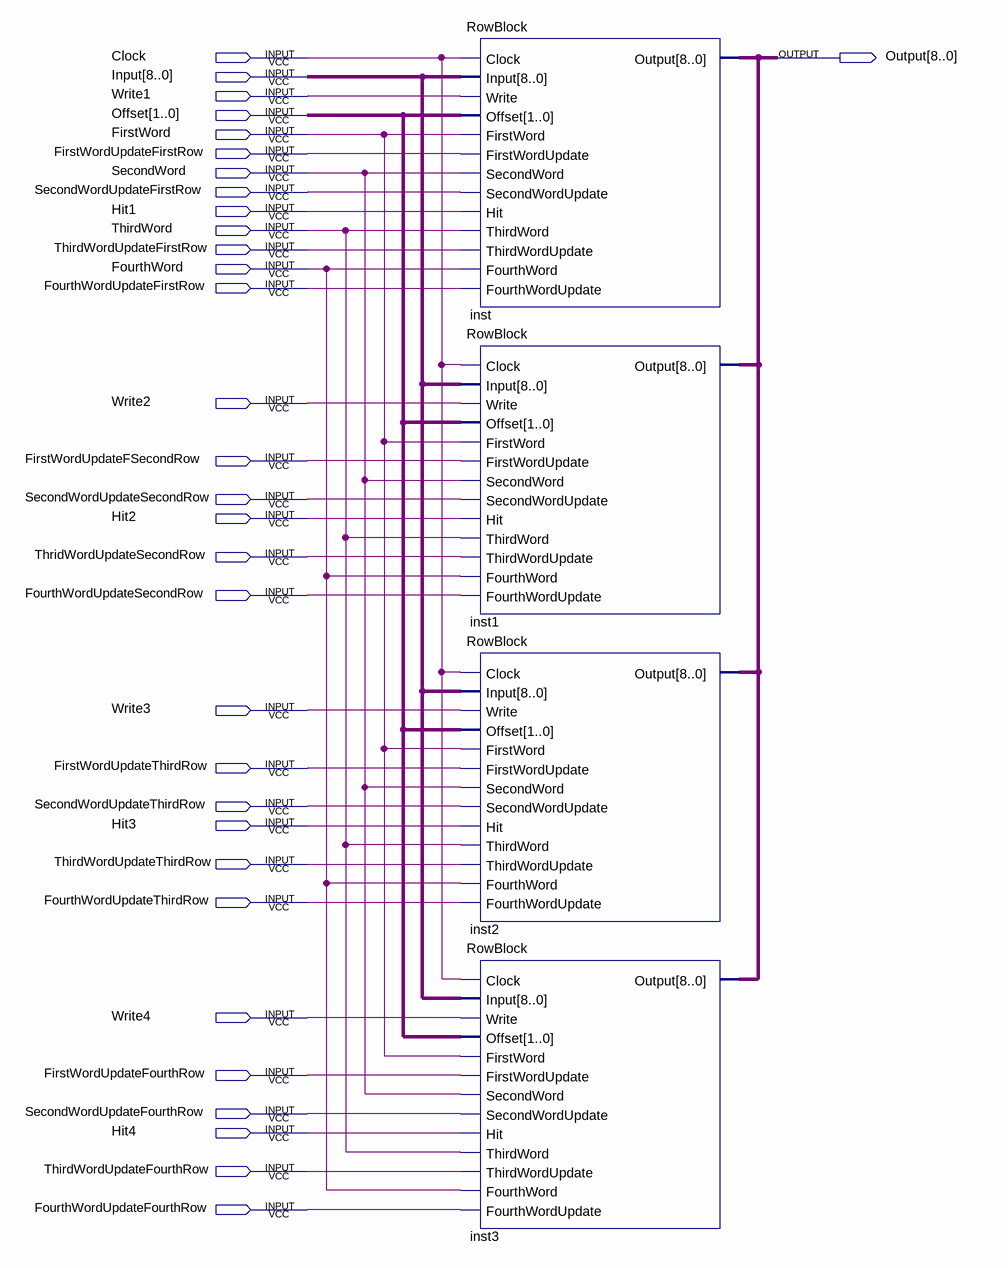
[diagram p0: schematic sheet]
// Quartus schematic BankBlock.bdf as structural Verilog: 4 symbols, 32 pins
module BankBlock (
  input  Clock,
  input  [8:0] Input,
  input  Write1,
  input  [1:0] Offset,
  input  FirstWord,
  input  FirstWordUpdateFirstRow,
  input  SecondWord,
  input  SecondWordUpdateFirstRow,
  input  Hit1,
  input  ThirdWord,
  input  ThirdWordUpdateFirstRow,
  input  FourthWord,
  input  FourthWordUpdateFirstRow,
  input  Write2,
  input  FirstWordUpdateFSecondRow,
  input  SecondWordUpdateSecondRow,
  input  Hit2,
  input  ThridWordUpdateSecondRow,
  input  FourthWordUpdateSecondRow,
  input  Write3,
  input  FirstWordUpdateThirdRow,
  input  SecondWordUpdateThirdRow,
  input  Hit3,
  input  ThirdWordUpdateThirdRow,
  input  FourthWordUpdateThirdRow,
  input  Write4,
  input  FirstWordUpdateFourthRow,
  input  SecondWordUpdateFourthRow,
  input  Hit4,
  input  ThirdWordUpdateFourthRow,
  input  FourthWordUpdateFourthRow,
  output [8:0] Output
);

  RowBlock inst (
    .Clock(Clock), .Input(Input), .Write(Write1), .Offset(Offset), .FirstWord(FirstWord),
    .FirstWordUpdate(FirstWordUpdateFirstRow), .SecondWord(SecondWord),
    .SecondWordUpdate(SecondWordUpdateFirstRow), .Hit(Hit1), .ThirdWord(ThirdWord),
    .ThirdWordUpdate(ThirdWordUpdateFirstRow), .FourthWord(FourthWord),
    .FourthWordUpdate(FourthWordUpdateFirstRow), .Output(Output));
  RowBlock inst1 (
    .Clock(Clock), .Input(Input), .Write(Write2), .Offset(Offset), .FirstWord(FirstWord),
    .FirstWordUpdate(FirstWordUpdateFSecondRow), .SecondWord(SecondWord),
    .SecondWordUpdate(SecondWordUpdateSecondRow), .Hit(Hit2), .ThirdWord(ThirdWord),
    .ThirdWordUpdate(ThridWordUpdateSecondRow), .FourthWord(FourthWord),
    .FourthWordUpdate(FourthWordUpdateSecondRow), .Output(Output));
  RowBlock inst2 (
    .Clock(Clock), .Input(Input), .Write(Write3), .Offset(Offset), .FirstWord(FirstWord),
    .FirstWordUpdate(FirstWordUpdateThirdRow), .SecondWord(SecondWord),
    .SecondWordUpdate(SecondWordUpdateThirdRow), .Hit(Hit3), .ThirdWord(ThirdWord),
    .ThirdWordUpdate(ThirdWordUpdateThirdRow), .FourthWord(FourthWord),
    .FourthWordUpdate(FourthWordUpdateThirdRow), .Output(Output));
  RowBlock inst3 (
    .Clock(Clock), .Input(Input), .Write(Write4), .Offset(Offset), .FirstWord(FirstWord),
    .FirstWordUpdate(FirstWordUpdateFourthRow), .SecondWord(SecondWord),
    .SecondWordUpdate(SecondWordUpdateFourthRow), .Hit(Hit4), .ThirdWord(ThirdWord),
    .ThirdWordUpdate(ThirdWordUpdateFourthRow), .FourthWord(FourthWord),
    .FourthWordUpdate(FourthWordUpdateFourthRow), .Output(Output));
endmodule
